# EAGLE design superlna (EAGLE 7.7.0)
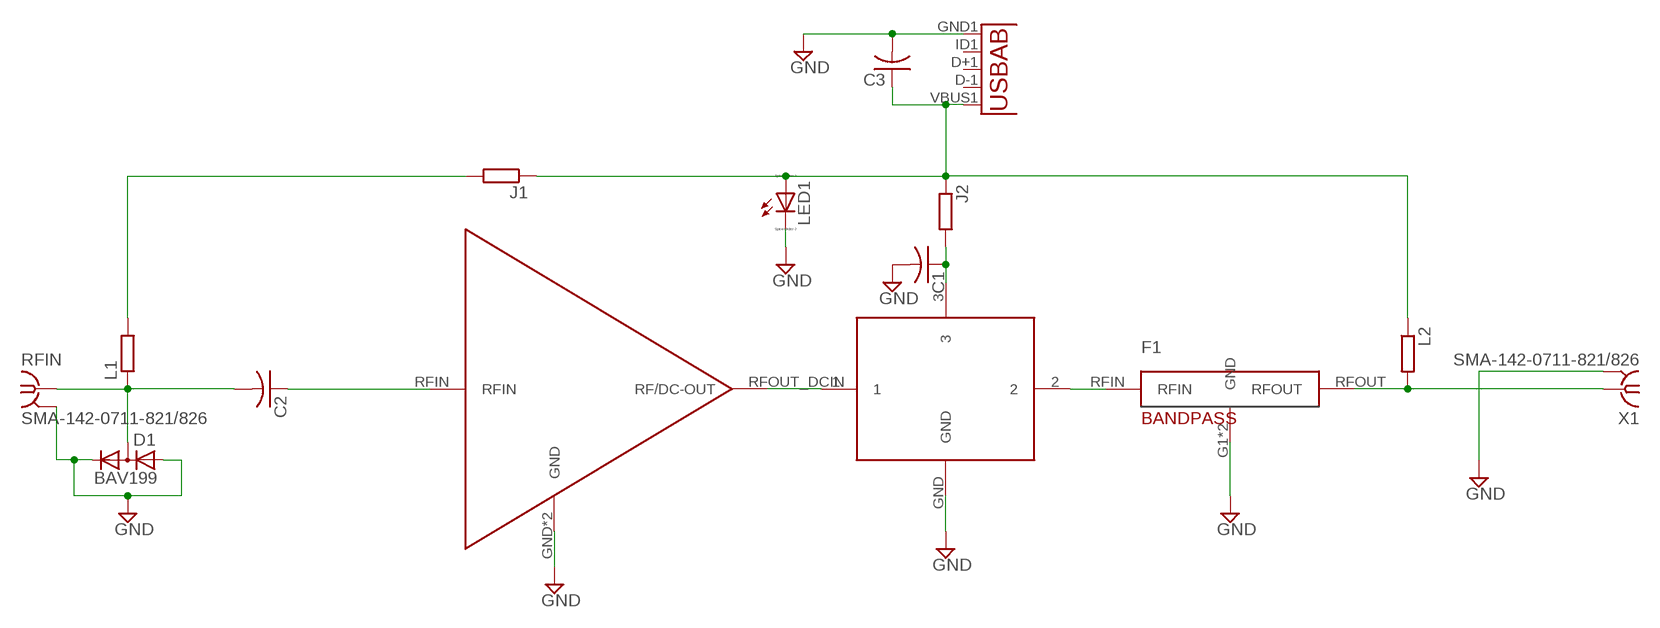
[diagram p0: schematic, sheet 1]

## Parts
C1  C-USC0402  [C0402]
C2  C-USC0402  [C0402]
C3  C-USC0402  [C0402]
D1  BAV199  [SOT23]
F1  BANDPASS  [FV1206]
J1  R-EU_R0805  [R0805]
J2  R-EU_R0805  [R0805]
L1  R-EU_R0805  [R0805]
L2  R-EU_R0805  [R0805]
LED1  LED_ESML0603  [LED_SML0603]
LNA  AMP  [SOC-343]
POWER  USB""  [USB-MICRO-SMD]
RFIN  SMA-142-0711-821/826  [J502-ND-142-0711-821/826]
U1  BIASTEE  [GU1414]
X1  SMA-142-0711-821/826  [J502-ND-142-0711-821/826]

## Nets
BIASPOWER: C1.1 J2.2 U1.3
GND: C1.2 C3.2 D1.1(A) D1.2(C) F1.G1(GND) F1.G2(GND) LED1.C LNA.GND LNA.GND1(GND) POWER.GND1(GND) RFIN.G@1 RFIN.G@2 RFIN.G@3 RFIN.G@4 U1.GND X1.G@1 X1.G@2 X1.G@3 X1.G@4
N$2: C2.1 LNA.RFIN
N$5: LNA.RFOUT_DCIN(RF/DC-OUT) U1.1
N$7: J1.2 L1.2
PWRIN: C3.1 J1.1 J2.1 L2.1 LED1.A POWER.VBUS1(VBUS)
RFIN: C2.2 D1.3(AC) L1.1 RFIN.1
RFOUT: F1.RFOUT L2.2 X1.1
RFOUT1: F1.RFIN U1.2
Unconnected: POWER.D+1(D+) POWER.D-1(D-) POWER.ID1(USBID)

## Library data of the parts
C1-C3 = rcl:C-US: CAPACITOR, American symbol
D1 = diode:BAV199: DIODE low-leakage double diode
F1 = custom:BANDPASS
J1 J2 L1 L2 = rcl:R-EU_: RESISTOR, European symbol
LED1 = eagle-ltspice:LED_E: LED Source: http://www.osram.convergy.de Source: www.luxeon.com Source: www.kingbright.com; SPICEMODEL: NONE; SPICEPREFIX: D; SPICETYPE: diode
LNA = minicircuits:AMP
POWER = microusb:USB: This is a USB AB connector that is compatible with USB OTG. i.e. this connector can serve as a host or device
RFIN X1 = con-coax:SMA-: SMA 50 Ohm End Launch Jack Receptacle - Round Contact Johnson Components Source: www.johnsoncomponents.com .. J502-ND.pdf; MF: JOHNSON COMPONENTS; MPN: 142-0711-821; OC_FARNELL: 1019328; OC_NEWARK: 16F3627
U1 = minicircuits:BIASTEE

## Board
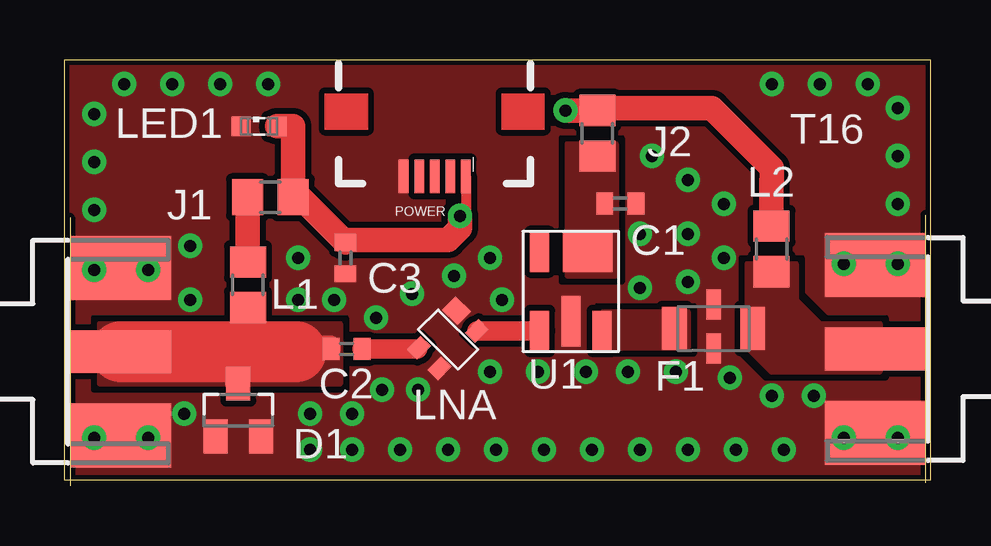
[diagram p1: board, top side]
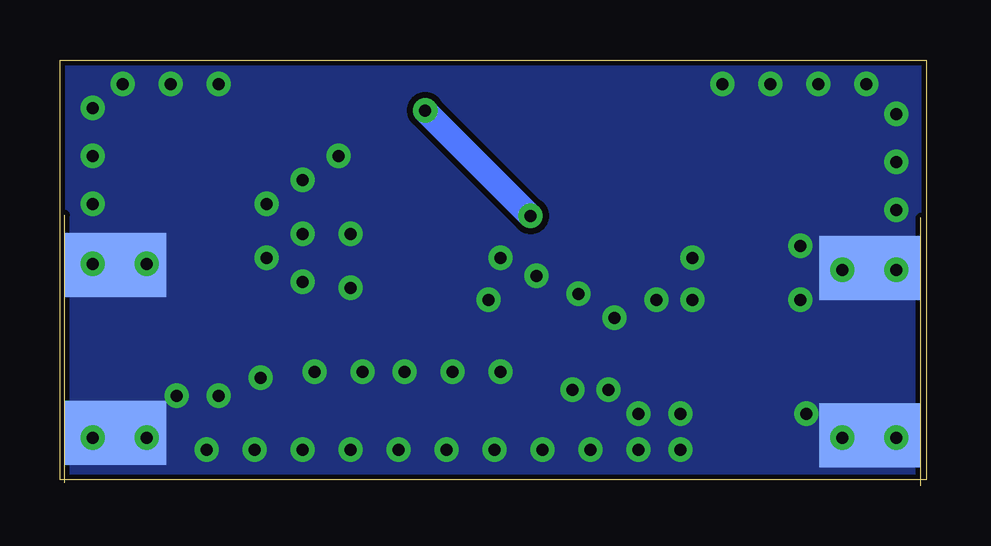
[diagram p2: board, bottom side, seen from below]

Size 36.12 x 17.5 mm. Coordinates in mm from the lower left corner, seen from the top.
Outline: 0,0 36.12,0 36.12,17.5 0,17.5 0,0
Copper layers (1*16): Top 0.035mm / dielectric 1.5mm / Bottom 0.035mm
Design rules "SparkFun-2-layer-STANDARD *": minimum track width 10mil, minimum drill 13mil, track to track 10mil, track to pad 8mil, pad to pad 8mil, via to via 10mil, smd to smd 8mil, copper to edge 8mil, drill to drill 8mil, minimum pad ring 10mil, minimum via ring 10mil, stop-mask expansion 4mil, vias tented up to drill 25mil, thermal gap 10mil

### Footprints (pad centres in the part's own frame; a part is rotated, then mirrored left to right if it is on the bottom)
C0402 = smd 0.7 x 0.9: 1 -0.65,0; 2 0.65,0
SOT23 = smd 1 x 1.4: 1 -0.95,-1.1; 2 0.95,-1.1; 3 0,1.1
FV1206 = smd 0.61 x 1.245: G1 0,-0.915; G2 0,0.915 | smd 1.04 x 1.8: RFIN -1.63,-0.09; RFOUT 1.63,-0.09
R0805 = smd 1.3 x 1.5: 1 -0.95,0; 2 0.95,0
LED_SML0603 = smd 0.8 x 0.8: A 0.75,0; C -0.75,0
SOC-343 = smd 0.9 x 0.8: GND 0.6,-1.1 | smd 0.6 x 0.8: GND1 -0.6,1.1; RFIN 0.615,1.1; RFOUT_DCIN -0.6,-1.1
USB-MICRO-SMD = smd 1.4 x 0.4: D+1 2.7,0; D-1 2.7,0.65; GND1 2.7,-1.3; ID1 2.7,-0.65; VBUS1 2.7,1.3
J502-ND-142-0711-821/826 = smd 4.191 x 1.778: 1 2.115,0 | smd 4.191 x 2.667: G@1 2.115,3.495; G@2 2.115,-3.495 | smd 4.191 x 2.667 bottom: G@3 2.115,3.495; G@4 2.115,-3.495
GU1414 = smd 0.79 x 1.68: 1 -1.3,-1.65; 2 1.3,-1.65; NC -1.3,1.65 | smd 2.06 x 1.68: 3 0.7,1.65 | smd 0.79 x 2.11: GND 0,-1.24

### Placement (x,y rotation side)
C1  23.18,11.51 0 top
C2  11.77,5.45 180 top
C3  11.73,9.24 270 top
D1  7.26,2.9 0 top
F1  27.07,6.39 0 top
J1  8.6,11.77 180 top
J2  22.23,14.44 270 top
L1  7.67,8.12 90 top
L2  29.49,9.62 270 top
LED1  8.13,14.73 0 top
LNA  16,5.84 135 top
POWER  15.45,15.35 270 top
RFIN  0.25,5.34 0 top
U1  21.12,7.85 0 top
X1  35.91,5.45 180 top

### Tracks (layer width: path | path; a pad name or v marks a point on that pad's centre or on a via)
BIASPOWER
  pour Top (no thermals): 23,8.5 21,8.5 21,14 23,14
GND  (via drill 0.5)
  other vias: 1.25,1.75 3.5,1.75 10.25,1.25 10.25,2.75 12,2.75 13.25,3.75 12,1.25 17.75,4.5 14.75,3.75 19.75,4.5 21.75,4.5 23.5,4.5 25.5,4.5 27.75,4.25 29.5,3.5 31.25,3.5 5,2.75 32.5,1.75 34.75,1.75 34.75,9 32.5,9 3.5,8.75 1.25,8.75 5.25,7.5 9.75,7.5 11.25,7.5 13,6.75 18.25,7.5 24,8 26,8.25 26,10.25 24,10.25 26,12.5 27.5,11.5 27.5,9.25 24.5,13.5 14.5,7.75 16.25,8.5 17.75,9.25 9.75,9.25 5.25,9.75 1.25,11.25 1.25,13.25 1.25,15.25 2.5,16.5 4.5,16.5 6.5,16.5 8.5,16.5 34.75,11.5 34.75,13.5 34.75,15.5 33.5,16.5 31.5,16.5 29.5,16.5 14,1.25 16,1.25 18,1.25 20,1.25 22,1.25 24,1.25 26,1.25 28,1.25 30,1.25
  pour Top (rank 2, no thermals): 0,17.5 36,17.5 36,0 0,0
  pour Bottom (no thermals): 0,17.5 36,17.5 36,0 0,0
N$2
  Top 0.254: 14.74,5.45 LNA.RFIN
  Top 0.813: C2.1 14.74,5.45
N$5
  Top 0.813: U1.1 LNA.RFOUT_DCIN
N$7
  Top 1.016: J1.2 7.65,9.09 L1.2
PWRIN  (via drill 0.5)
  Top 0.406: POWER.VBUS1 16.75,11.25 v16.5,11
  Top 1.016: LED1.A 9.55,14.73 J1.1 9.84,11.77 C3.1 11.84,10 16,10 16.5,10.5 v16.5,11 | v20.89,15.39 J2.1 22.34,15.5 27,15.5 29.5,13 29.5,12.5 29.49,12.49 L2.1
  Bottom 1.016: v20.89,15.39 v16.5,11
RFIN
  Top 0.254: 9.65,5.34 9.65,5.59
  Top 0.813: 9.65,5.59 11.12,5.59 C2.2 | L1.1 7.62,7.17 7.62,5.34 | D1.3 7.11,4 7.11,5.34
  Top 2.54: RFIN.1 7.11,5.34 7.62,5.34 9.65,5.34
  pour Top (no thermals): 1.5,6.5 11.5,6.5 11.5,4 1.5,4
RFOUT
  pour Top (no thermals): 34,6.5 34,4.5 29.5,4.5 28.5,5.5 28.5,9 30.5,9 30.5,7.5 31.5,6.5
RFOUT1
  pour Top (no thermals): 22.5,7 26,7 26,5.5 22.5,5.5

### Text on the board
tPlace: T16